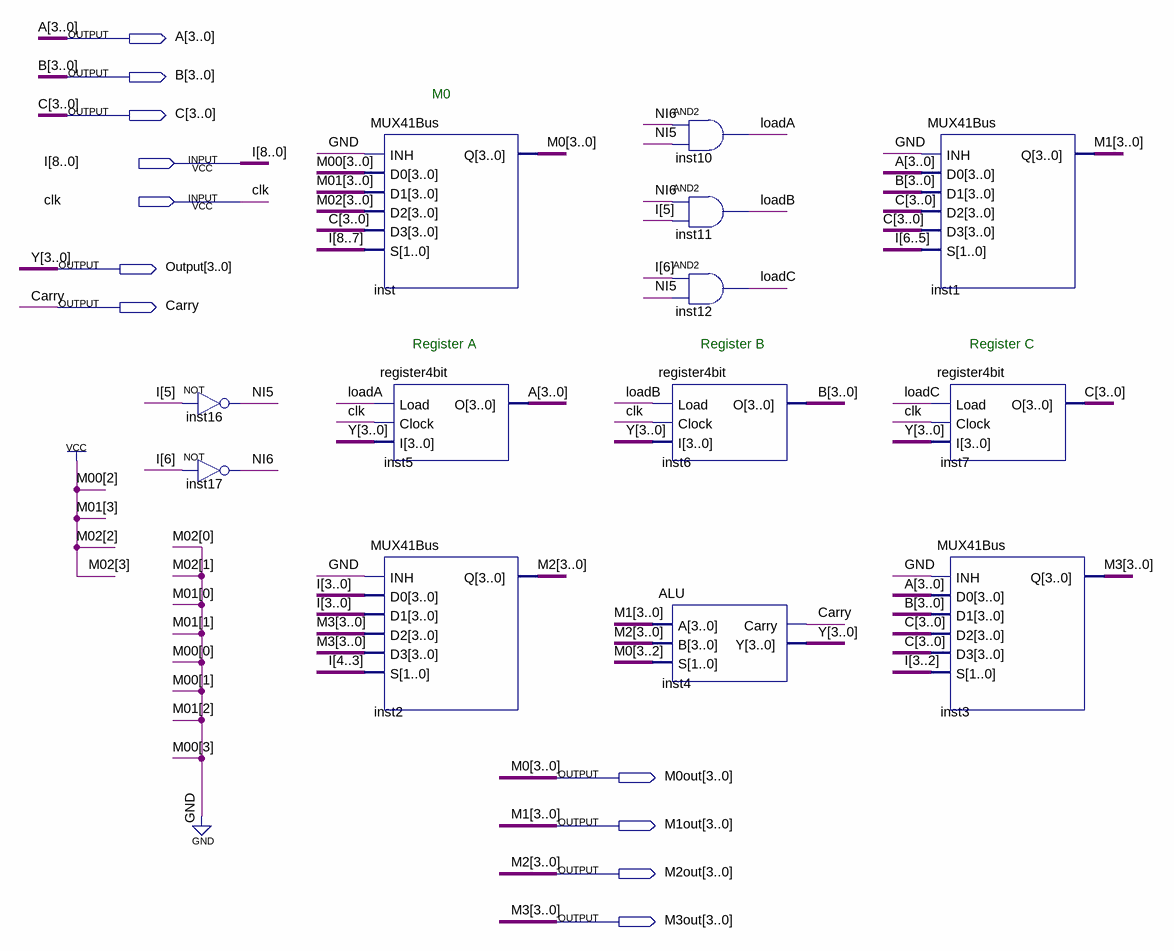
[diagram p0: schematic sheet]
// Quartus schematic EU.bdf as structural Verilog: 13 symbols, 11 pins
module EU (
  input  [8:0] I,
  input  clk,
  output [3:0] A,
  output [3:0] B,
  output [3:0] C,
  output [3:0] Output,
  output Carry,
  output [3:0] M0out,
  output [3:0] M1out,
  output [3:0] M2out,
  output [3:0] M3out
);

  wire loadA, loadB, loadC, NI5, NI6;

  not inst16 (NI5, I[5]);
  not inst17 (NI6, I[6]);
  MUX41Bus inst (.INH(1'b0), .D0(4'b0100), .D1(4'b1000), .D2(4'b1100), .D3(C), .S(I[8:7]), .Q(M0out));
  register4bit inst5 (.Load(loadA), .Clock(clk), .I(Output), .O(A));
  MUX41Bus inst2 (.INH(1'b0), .D0(I[3:0]), .D1(I[3:0]), .D2(M3out), .D3(M3out), .S(I[4:3]), .Q(M2out));
  and inst10 (loadA, NI6, NI5);
  and inst11 (loadB, NI6, I[5]);
  and inst12 (loadC, I[6], NI5);
  register4bit inst6 (.Load(loadB), .Clock(clk), .I(Output), .O(B));
  ALU inst4 (.A(M1out), .B(M2out), .S(M0out[3:2]), .Carry(Carry), .Y(Output));
  MUX41Bus inst1 (.INH(1'b0), .D0(A), .D1(B), .D2(C), .D3(C), .S(I[6:5]), .Q(M1out));
  register4bit inst7 (.Load(loadC), .Clock(clk), .I(Output), .O(C));
  MUX41Bus inst3 (.INH(1'b0), .D0(A), .D1(B), .D2(C), .D3(C), .S(I[3:2]), .Q(M3out));

  // Other names for the same wires on the sheet: M0[3:0] = M0out; M1[3:0] = M1out; M2[3:0] = M2out; M3[3:0] = M3out;
  //   Y[3:0] = Output

  // Notes on the sheet:
  //   M0
  //   Register A
  //   Register B
  //   Register C
endmodule
